# Altium schematic sheet MCU.SchDoc: MCU
size A3; Date: 13/11/2025; DrawnBy: Văn Quý Tuân; Revision: 1; SheetNumber: 2; SheetTotal: 10; Size: A3; Subsystem: HW-11/11/25
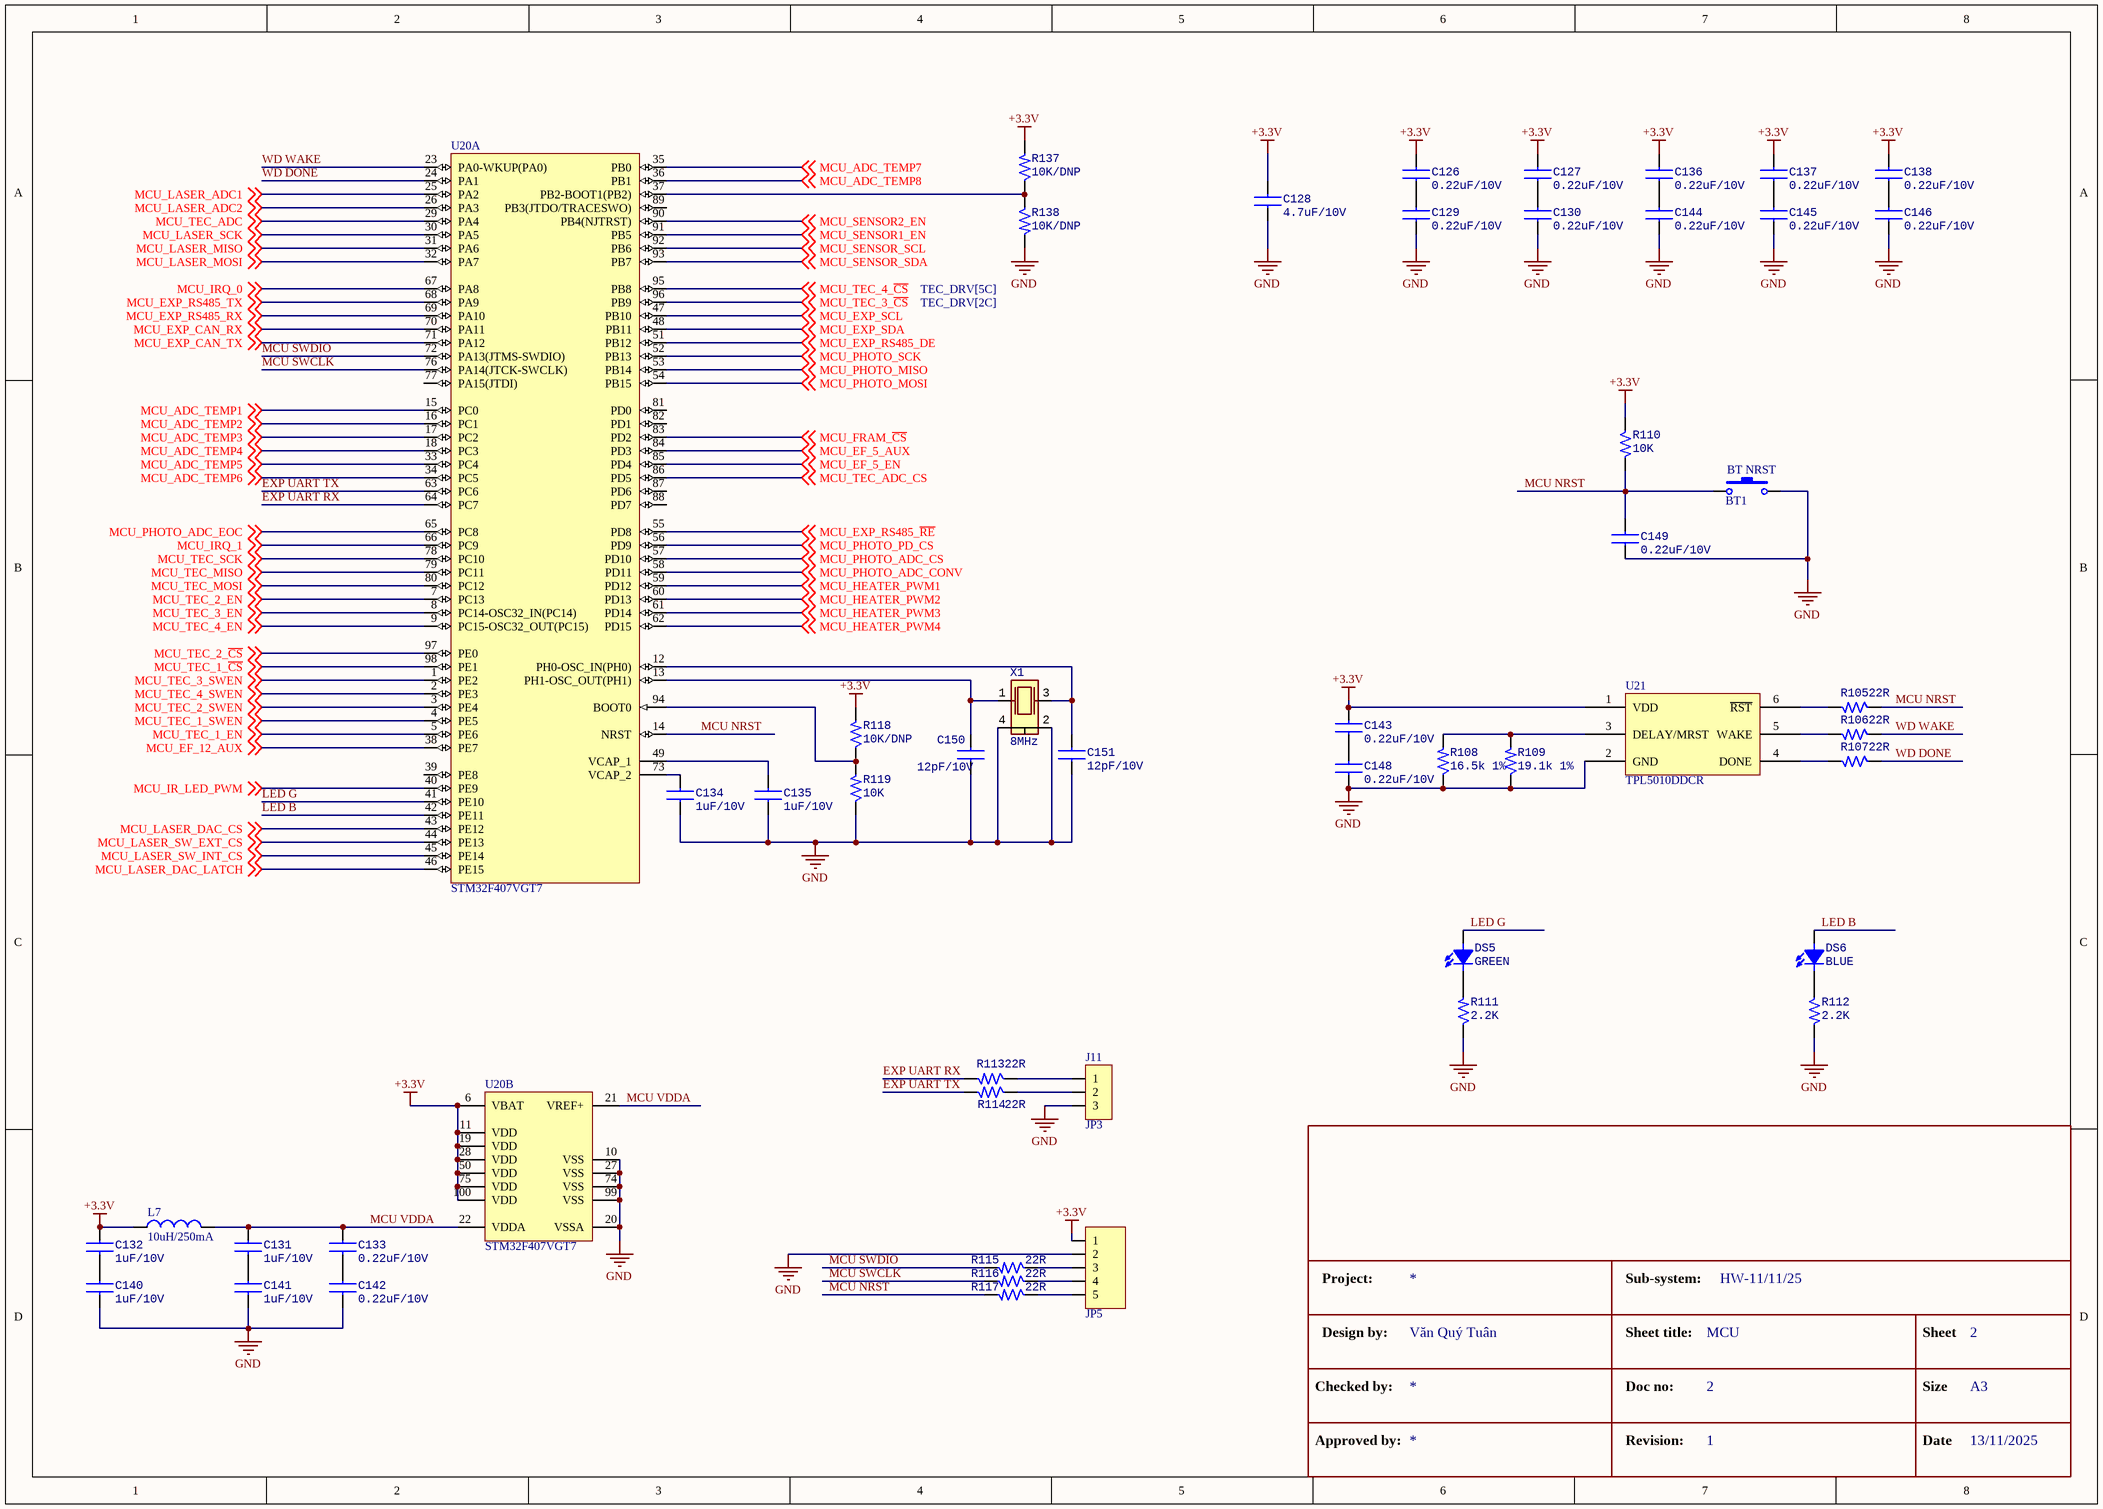
[diagram p0: MCU.SchDoc]

## Parts
BT1  BT NRST  [SW-SMD]
C126  0.22uF/10V  [CAP-CER-0603]
C127  0.22uF/10V  [CAP-CER-0603]
C128  4.7uF/10V  [CAP-CER-0603]
C129  0.22uF/10V  [CAP-CER-0603]
C130  0.22uF/10V  [CAP-CER-0603]
C131  1uF/10V  [CAP-CER-0603]
C132  1uF/10V  [CAP-CER-0603]
C133  0.22uF/10V  [CAP-CER-0603]
C134  1uF/10V  [CAP-CER-0603]
C135  1uF/10V  [CAP-CER-0603]
C136  0.22uF/10V  [CAP-CER-0603]
C137  0.22uF/10V  [CAP-CER-0603]
C138  0.22uF/10V  [CAP-CER-0603]
C140  1uF/10V  [CAP-CER-0603]
C141  1uF/10V  [CAP-CER-0603]
C142  0.22uF/10V  [CAP-CER-0603]
C143  0.22uF/10V  [CAP-CER-0603]
C144  0.22uF/10V  [CAP-CER-0603]
C145  0.22uF/10V  [CAP-CER-0603]
C146  0.22uF/10V  [CAP-CER-0603]
C148  0.22uF/10V  [CAP-CER-0603]
C149  0.22uF/10V  [CAP-CER-0603]
C150  12pF/10V  [CAP-CER-0603]
C151  12pF/10V  [CAP-CER-0603]
DS5  GREEN  [LED-SMD-0603]
DS6  BLUE  [LED-SMD-0603]
J6  JP5  [JP 1x5 CT]
J11  JP3  [JP 1x3 CT]
L7  10uH/250mA  [INDUCT-SMD-0603]
R105  22R  [RES-SMD-0603]
R106  22R  [RES-SMD-0603]
R107  22R  [RES-SMD-0603]
R108  16.5k 1%  [RES-SMD-0603]
R109  19.1k 1%  [RES-SMD-0603]
R110  10K  [RES-SMD-0603]
R111  2.2K  [RES-SMD-0603]
R112  2.2K  [RES-SMD-0603]
R113  22R  [RES-SMD-0603]
R114  22R  [RES-SMD-0603]
R115  22R  [RES-SMD-0603]
R116  22R  [RES-SMD-0603]
R117  22R  [RES-SMD-0603]
R118  10K/DNP  [RES-SMD-0603]
R119  10K  [RES-SMD-0603]
R137  10K/DNP  [RES-SMD-0603]
R138  10K/DNP  [RES-SMD-0603]
U20  STM32F407VGT7  [STM-LQFP100_V]  (parts A,B of 2)
U21  TPL5010DDCR  [TPL5010DDCR]
X1  8MHz  [CRYSTAL-4POS-3.2x2.5]

## Nets
+3.3V: C126.1 C127.1 C128.1 C132.1 C136.1 C137.1 C138.1 C143.1 J6.1 L7.1 R110.1 R118.2 R137.2 U20.6(VBAT) U20.11(VDD) U20.19(VDD) U20.28(VDD) U20.50(VDD) U20.75(VDD) U20.100(VDD) U21.1(VDD)
GND: BT1.2 C128.2 C129.2 C130.2 C134.2 C135.2 C140.2 C141.2 C142.2 C144.2 C145.2 C146.2 C148.2 C149.2 C150.2 C151.2 J6.2 J11.3 R108.1 R109.1 R111.1 R112.2 R119.1 R138.2 U20.10(VSS) U20.20(VSSA) U20.27(VSS) U20.74(VSS) U20.99(VSS) U21.2(GND) X1.2 X1.4
EXP UART RX: R113.2 U20.64(PC7)
EXP UART TX: R114.2 U20.63(PC6)
LED B: DS6.A U20.42(PE11)
LED G: DS5.A U20.41(PE10)
MCU NRST: BT1.1 C149.1 R105.1 R110.2 R117.2 U20.14(NRST)
MCU SWCLK: R116.2 U20.76(PA14(JTCK-SWCLK))
MCU SWDIO: R115.2 U20.72(PA13(JTMS-SWDIO))
MCU VDDA: C131.1 C133.1 L7.2 U20.21(VREF+) U20.22(VDDA)
MCU_ADC_TEMP1: U20.15(PC0) ; off-sheet MCU_ADC_TEMP1
MCU_ADC_TEMP2: U20.16(PC1) ; off-sheet MCU_ADC_TEMP2
MCU_ADC_TEMP3: U20.17(PC2) ; off-sheet MCU_ADC_TEMP3
MCU_ADC_TEMP4: U20.18(PC3) ; off-sheet MCU_ADC_TEMP4
MCU_ADC_TEMP5: U20.33(PC4) ; off-sheet MCU_ADC_TEMP5
MCU_ADC_TEMP6: U20.34(PC5) ; off-sheet MCU_ADC_TEMP6
MCU_ADC_TEMP7: U20.35(PB0) ; off-sheet MCU_ADC_TEMP7
MCU_ADC_TEMP8: U20.36(PB1) ; off-sheet MCU_ADC_TEMP8
MCU_EF_5_AUX: U20.84(PD3) ; off-sheet MCU_EF_5_AUX
MCU_EF_5_EN: U20.85(PD4) ; off-sheet MCU_EF_5_EN
MCU_EF_12_AUX: U20.38(PE7) ; off-sheet MCU_EF_12_AUX
MCU_EXP_CAN_RX: U20.70(PA11) ; off-sheet MCU_EXP_CAN_RX
MCU_EXP_CAN_TX: U20.71(PA12) ; off-sheet MCU_EXP_CAN_TX
MCU_EXP_RS485_DE: U20.51(PB12) ; off-sheet MCU_EXP_RS485_DE
MCU_EXP_RS485_~{RE}: U20.55(PD8) ; off-sheet MCU_EXP_RS485_~{RE}
MCU_EXP_RS485_RX: U20.69(PA10) ; off-sheet MCU_EXP_RS485_RX
MCU_EXP_RS485_TX: U20.68(PA9) ; off-sheet MCU_EXP_RS485_TX
MCU_EXP_SCL: U20.47(PB10) ; off-sheet MCU_EXP_SCL
MCU_EXP_SDA: U20.48(PB11) ; off-sheet MCU_EXP_SDA
MCU_FRAM_~{CS}: U20.83(PD2) ; off-sheet MCU_FRAM_~{CS}
MCU_HEATER_PWM1: U20.59(PD12) ; off-sheet MCU_HEATER_PWM1
MCU_HEATER_PWM2: U20.60(PD13) ; off-sheet MCU_HEATER_PWM2
MCU_HEATER_PWM3: U20.61(PD14) ; off-sheet MCU_HEATER_PWM3
MCU_HEATER_PWM4: U20.62(PD15) ; off-sheet MCU_HEATER_PWM4
MCU_IR_LED_PWM: U20.40(PE9) ; off-sheet MCU_IR_LED_PWM
MCU_IRQ_0: U20.67(PA8) ; off-sheet MCU_IRQ_0
MCU_IRQ_1: U20.66(PC9) ; off-sheet MCU_IRQ_1
MCU_LASER_ADC1: U20.25(PA2) ; off-sheet MCU_LASER_ADC1
MCU_LASER_ADC2: U20.26(PA3) ; off-sheet MCU_LASER_ADC2
MCU_LASER_DAC_CS: U20.43(PE12) ; off-sheet MCU_LASER_DAC_CS
MCU_LASER_DAC_LATCH: U20.46(PE15) ; off-sheet MCU_LASER_DAC_LATCH
MCU_LASER_MISO: U20.31(PA6) ; off-sheet MCU_LASER_MISO
MCU_LASER_MOSI: U20.32(PA7) ; off-sheet MCU_LASER_MOSI
MCU_LASER_SCK: U20.30(PA5) ; off-sheet MCU_LASER_SCK
MCU_LASER_SW_EXT_CS: U20.44(PE13) ; off-sheet MCU_LASER_SW_EXT_CS
MCU_LASER_SW_INT_CS: U20.45(PE14) ; off-sheet MCU_LASER_SW_INT_CS
MCU_PHOTO_ADC_CONV: U20.58(PD11) ; off-sheet MCU_PHOTO_ADC_CONV
MCU_PHOTO_ADC_CS: U20.57(PD10) ; off-sheet MCU_PHOTO_ADC_CS
MCU_PHOTO_ADC_EOC: U20.65(PC8) ; off-sheet MCU_PHOTO_ADC_EOC
MCU_PHOTO_MISO: U20.53(PB14) ; off-sheet MCU_PHOTO_MISO
MCU_PHOTO_MOSI: U20.54(PB15) ; off-sheet MCU_PHOTO_MOSI
MCU_PHOTO_PD_CS: U20.56(PD9) ; off-sheet MCU_PHOTO_PD_CS
MCU_PHOTO_SCK: U20.52(PB13) ; off-sheet MCU_PHOTO_SCK
MCU_SENSOR1_EN: U20.91(PB5) ; off-sheet MCU_SENSOR1_EN
MCU_SENSOR2_EN: U20.90(PB4(NJTRST)) ; off-sheet MCU_SENSOR2_EN
MCU_SENSOR_SCL: U20.92(PB6) ; off-sheet MCU_SENSOR_SCL
MCU_SENSOR_SDA: U20.93(PB7) ; off-sheet MCU_SENSOR_SDA
MCU_TEC_1_~{CS}: U20.98(PE1) ; off-sheet MCU_TEC_1_~{CS}
MCU_TEC_1_EN: U20.5(PE6) ; off-sheet MCU_TEC_1_EN
MCU_TEC_1_SWEN: U20.4(PE5) ; off-sheet MCU_TEC_1_SWEN
MCU_TEC_2_~{CS}: U20.97(PE0) ; off-sheet MCU_TEC_2_~{CS}
MCU_TEC_2_EN: U20.7(PC13) ; off-sheet MCU_TEC_2_EN
MCU_TEC_2_SWEN: U20.3(PE4) ; off-sheet MCU_TEC_2_SWEN
MCU_TEC_3_~{CS}: U20.96(PB9) ; off-sheet MCU_TEC_3_~{CS}
MCU_TEC_3_EN: U20.8(PC14-OSC32_IN(PC14)) ; off-sheet MCU_TEC_3_EN
MCU_TEC_3_SWEN: U20.1(PE2) ; off-sheet MCU_TEC_3_SWEN
MCU_TEC_4_~{CS}: U20.95(PB8) ; off-sheet MCU_TEC_4_~{CS}
MCU_TEC_4_EN: U20.9(PC15-OSC32_OUT(PC15)) ; off-sheet MCU_TEC_4_EN
MCU_TEC_4_SWEN: U20.2(PE3) ; off-sheet MCU_TEC_4_SWEN
MCU_TEC_ADC: U20.29(PA4) ; off-sheet MCU_TEC_ADC
MCU_TEC_ADC_CS: U20.86(PD5) ; off-sheet MCU_TEC_ADC_CS
MCU_TEC_MISO: U20.79(PC11) ; off-sheet MCU_TEC_MISO
MCU_TEC_MOSI: U20.80(PC12) ; off-sheet MCU_TEC_MOSI
MCU_TEC_SCK: U20.78(PC10) ; off-sheet MCU_TEC_SCK
WD DONE: R107.1 U20.24(PA1)
WD WAKE: R106.1 U20.23(PA0-WKUP(PA0))
NetC126_2: C126.2 C129.1
NetC127_2: C127.2 C130.1
NetC131_2: C131.2 C141.1
NetC132_2: C132.2 C140.1
NetC133_2: C133.2 C142.1
NetC134_1: C134.1 U20.73(VCAP_2)
NetC135_1: C135.1 U20.49(VCAP_1)
NetC136_2: C136.2 C144.1
NetC137_2: C137.2 C145.1
NetC138_2: C138.2 C146.1
NetC143_2: C143.2 C148.1
NetC150_1: C150.1 U20.13(PH1-OSC_OUT(PH1)) X1.1
NetC151_1: C151.1 U20.12(PH0-OSC_IN(PH0)) X1.3
NetDS5_K: DS5.K R111.2
NetDS6_K: DS6.K R112.1
NetJ6_3: J6.3 R115.1
NetJ6_4: J6.4 R116.1
NetJ6_5: J6.5 R117.1
NetJ11_1: J11.1 R113.1
NetJ11_2: J11.2 R114.1
NetR105_2: R105.2 U21.6(~{RST})
NetR106_2: R106.2 U21.5(WAKE)
NetR107_2: R107.2 U21.4(DONE)
NetR108_2: R108.2 R109.2 U21.3(DELAY/MRST)
NetR118_1: R118.1 R119.2 U20.94(BOOT0)
NetR137_1: R137.1 R138.1 U20.37(PB2-BOOT1(PB2))

Not connected (* = marked no-connect by the designer): U20 39(PE8) 77(PA15(JTDI)) 81(PD0) 82(PD1) 87(PD6) 88(PD7) 89(PB3(JTDO/TRACESWO))

## Notes on the sheet
- Project:
- Sub-system:
- Checked by:
- Design by:
- Sheet title:
- Doc no:
- Sheet
- Size
- Approved by:
- Revision:
- Date
- Text

## Library data of the parts
BT1 = SW-SMD: Switch; Published: 24-Mar-1999; LatestRevisionDate: 17-Jul-2002; LatestRevisionNote: Re-released for DXP Platform.; PackageReference: SPST-2; Publisher: Altium Limited
C126-C138 C140-C146 C148-C151 = CAP-CER
DS5 DS6 = LED
J6 = JP 1x5 2.54 Cai Thang: 1X5 2.54; Ten_Linh_Kien: Jump Đơn Cái 2.54MM 1x20P Thẳng; Don_Vi: Con; Ma_Hang: MH004006; Chung_Loai: Cắm; Ghi_Chu: *; Kieu_Chan: *
J11 = JP 1x3 2.54 Cai Thang: 1X3 2.54; Ten_Linh_Kien: Jump Đơn Cái 2.54MM 1x20P Thẳng; Don_Vi: Con; Ma_Hang: MH004006; Chung_Loai: Cắm; Ghi_Chu: *; Kieu_Chan: *
L7 = INDUCT-SMD: MP: LQM18PZ2R2MFHD; MF: Murata; Price: None; Package: 1608 Murata; Value: *; SnapEDA_Link: https://www.snapeda.com/parts/LQM18PZ2R2MFHD/Murata/view-part/1498702/?ref=snap; Availability: Good; Check_prices: https://www.snapeda.com/parts/LQM18PZ2R2MFHD/Murata/view-part/1498702/?ref=eda; Purchase-URL: https://pricing.snapeda.com/search/part/LQM18PZ2R2MFHD/?ref=eda
R105-R119 R137 R138 = RES-SMD
U20 = STM32F407VGT7: ARM Cortex-M4 32-bit MCU+FPU, 210 DMIPS, 1024 kB Flash, 192 kB Internal RAM, 82 I/Os, 100-pin LQFP, -40 to 105 degC, Tray; Manufacturer: STMicroelectronics; D/A Converter: 2x12-bit; FLASH Size (Prog) (kB): 1024; I/Os (High Current): 82; Internal RAM Size (kB): 192; Operating Frequency(F) (Processor speed) (MHz): 168; Supply Voltage(Vcc) max (V): 3.6; Supply Voltage(Vcc) min (V): 1.8; DatasheetVersion: Rev. 4; PackageVersion: Rev. 1, 06/2013; PackageReference: LQFP100; PackageDescription: 100-Pin Low Profile Quad Flat Package, 14 x 14 mm Body, 0.5 mm Pitch; Supplier 1: Digi-Key; Supplier Part Number 1: STM32F407VGT7-ND; Supplier 2: Farnell; Supplier Part Number 2: 2333298; Supplier 3: Newark; Supplier Part Number 3: 99W9914; Supplier 4: Newark; Supplier Part Number 4: 48W6905; Supplier 5: Mouser; Supplier Part Number 5: 511-STM32F407VGT7; Core: ARM Cortex-M4; Packing: Tray; Mounting Technology: Surface Mount; PartNumber: STM32F407VGT7; ComponentLink1Description: Manufacturer URL; ComponentLink1URL: http://www.st.com/web/en/home.html; ComponentLink2Description: Datasheet; ComponentLink2URL: http://www.st.com/st-web-ui/static/active/en/resource/technical/document/datasheet/DM00037051.pdf; ComponentLink3Description: Package Specification; ComponentLink3URL: http://www.st.com/st-web-ui/static/active/en/resource/technical/document/data_brief/DM00071938.pdf
X1 = CRYSTAL-4POS: Crystal, 8 MHz, -30 to 85 degC, 3.2 x 2.5 x 0.9 mm SMD